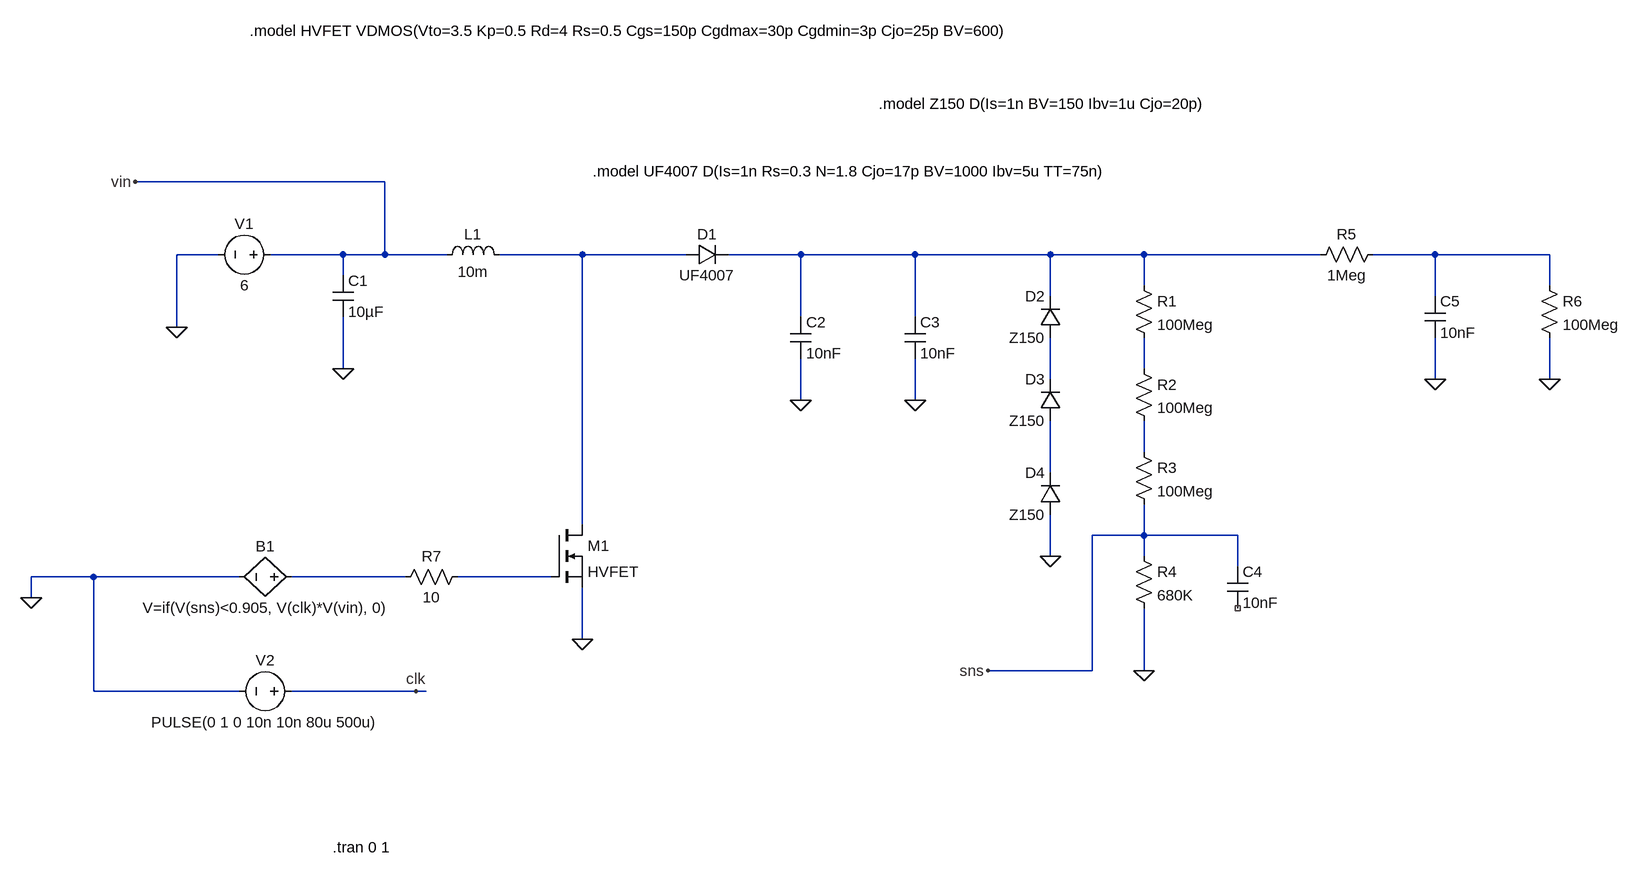
[diagram p0: schematic Draft1.asc]
Draft1.asc, the LTspice schematic file:
Version 4.1
SHEET 1 2132 880
WIRE 224 -160 -160 -160
WIRE -32 -48 -96 -48
WIRE 160 -48 48 -48
WIRE 224 -48 224 -160
WIRE 224 -48 160 -48
WIRE 320 -48 224 -48
WIRE 528 -48 400 -48
WIRE 688 -48 528 -48
WIRE 864 -48 752 -48
WIRE 1040 -48 864 -48
WIRE 1248 -48 1040 -48
WIRE 1392 -48 1248 -48
WIRE 1664 -48 1392 -48
WIRE 1840 -48 1744 -48
WIRE 2016 -48 1840 -48
WIRE 160 -16 160 -48
WIRE 1392 0 1392 -48
WIRE 2016 0 2016 -48
WIRE 1248 16 1248 -48
WIRE 1840 16 1840 -48
WIRE 864 48 864 -48
WIRE 1040 48 1040 -48
WIRE -96 64 -96 -48
WIRE 160 128 160 48
WIRE 1392 128 1392 80
WIRE 1248 144 1248 80
WIRE 1840 144 1840 80
WIRE 2016 144 2016 80
WIRE 864 176 864 112
WIRE 1040 176 1040 112
WIRE 1392 256 1392 208
WIRE 1248 288 1248 208
WIRE 528 368 528 -48
WIRE 1392 384 1392 336
WIRE 1392 384 1312 384
WIRE 1536 384 1392 384
WIRE 1248 416 1248 352
WIRE 1392 416 1392 384
WIRE 1536 432 1536 384
WIRE -224 448 -320 448
WIRE 0 448 -224 448
WIRE 256 448 80 448
WIRE 480 448 336 448
WIRE -320 480 -320 448
WIRE 528 544 528 464
WIRE 1312 592 1312 384
WIRE 1312 592 1152 592
WIRE 1392 592 1392 496
WIRE -224 624 -224 448
WIRE 0 624 -224 624
WIRE 272 624 80 624
WIRE 288 624 272 624
FLAG -160 -160 vin
FLAG 1152 592 sns
FLAG -320 480 0
FLAG 272 624 clk
FLAG 528 544 0
FLAG -96 64 0
FLAG 1392 592 0
FLAG 1840 144 0
FLAG 2016 144 0
FLAG 1248 416 0
FLAG 1040 176 0
FLAG 864 176 0
FLAG 160 128 0
SYMBOL voltage 64 -48 R90
WINDOW 0 -32 56 VBottom 2
WINDOW 3 32 56 VTop 2
SYMATTR InstName V1
SYMATTR Value 6
SYMBOL cap 144 -16 R0
SYMATTR InstName C1
SYMATTR Value 10µF
SYMBOL ind 304 -32 R270
WINDOW 0 32 56 VTop 2
WINDOW 3 5 56 VBottom 2
SYMATTR InstName L1
SYMATTR Value 10m
SYMATTR SpiceLine Ipk=0.1 Rser=12 Cpar=15p
SYMBOL diode 688 -32 R270
WINDOW 0 32 32 VTop 2
WINDOW 3 0 32 VBottom 2
SYMATTR InstName D1
SYMATTR Value UF4007
SYMBOL cap 848 48 R0
SYMATTR InstName C2
SYMATTR Value 10nF
SYMATTR SpiceLine V=1000
SYMBOL cap 1024 48 R0
SYMATTR InstName C3
SYMATTR Value 10nF
SYMATTR SpiceLine V=1000
SYMBOL diode 1264 80 R180
WINDOW 0 24 64 Left 2
WINDOW 3 24 0 Left 2
SYMATTR InstName D2
SYMATTR Value Z150
SYMBOL diode 1264 208 R180
WINDOW 0 24 64 Left 2
WINDOW 3 24 0 Left 2
SYMATTR InstName D3
SYMATTR Value Z150
SYMBOL diode 1264 352 R180
WINDOW 0 24 64 Left 2
WINDOW 3 24 0 Left 2
SYMATTR InstName D4
SYMATTR Value Z150
SYMBOL res 1376 -16 R0
SYMATTR InstName R1
SYMATTR Value 100Meg
SYMBOL res 1376 112 R0
SYMATTR InstName R2
SYMATTR Value 100Meg
SYMBOL res 1376 240 R0
SYMATTR InstName R3
SYMATTR Value 100Meg
SYMBOL res 1376 400 R0
SYMATTR InstName R4
SYMATTR Value 680K
SYMBOL cap 1520 432 R0
SYMATTR InstName C4
SYMATTR Value 10nF
SYMBOL res 1760 -64 R90
WINDOW 0 0 56 VBottom 2
WINDOW 3 32 56 VTop 2
SYMATTR InstName R5
SYMATTR Value 1Meg
SYMBOL res 2000 -16 R0
SYMATTR InstName R6
SYMATTR Value 100Meg
SYMBOL cap 1824 16 R0
SYMATTR InstName C5
SYMATTR Value 10nF
SYMBOL voltage 96 624 R90
WINDOW 0 -32 56 VBottom 2
WINDOW 3 32 56 VTop 2
WINDOW 123 0 0 Left 0
WINDOW 39 0 0 Left 0
SYMATTR InstName V2
SYMATTR Value PULSE(0 1 0 10n 10n 80u 500u)
SYMBOL bv 96 448 R90
WINDOW 0 -32 56 VBottom 2
WINDOW 3 32 56 VTop 2
SYMATTR InstName B1
SYMATTR Value V=if(V(sns)<0.905, V(clk)*V(vin), 0)
SYMBOL res 352 432 R90
WINDOW 0 0 56 VBottom 2
WINDOW 3 32 56 VTop 2
SYMATTR InstName R7
SYMATTR Value 10
SYMBOL nmos 480 368 R0
SYMATTR InstName M1
SYMATTR Value HVFET
TEXT 544 -176 Left 2 !.model UF4007 D(Is=1n Rs=0.3 N=1.8 Cjo=17p BV=1000 Ibv=5u TT=75n)
TEXT 984 -280 Left 2 !.model Z150 D(Is=1n BV=150 Ibv=1u Cjo=20p)
TEXT 16 -392 Left 2 !.model HVFET VDMOS(Vto=3.5 Kp=0.5 Rd=4 Rs=0.5 Cgs=150p Cgdmax=30p Cgdmin=3p Cjo=25p BV=600)
TEXT 144 864 Left 2 !.tran 0 1

The netlist it stands for:
* Draft1.asc
V1 vin 0 6
C1 vin 0 10µF
L1 vin N001 10m Ipk=0.1 Rser=12 Cpar=15p
D1 N001 N002 UF4007
C2 N002 0 10nF V=1000
C3 N002 0 10nF V=1000
D2 N005 N002 Z150
D3 N007 N005 Z150
D4 0 N007 Z150
R1 N002 N004 100Meg
R2 N004 N006 100Meg
R3 N006 sns 100Meg
R4 sns 0 680K
C4 sns NC_01 10nF
R5 N003 N002 1Meg
R6 N003 0 100Meg
C5 N003 0 10nF
V2 clk 0 PULSE(0 1 0 10n 10n 80u 500u)
B1 N008 0 V=if(V(sns)<0.905, V(clk)*V(vin), 0)
R7 N009 N008 10
M1 N001 N009 0 0 HVFET
.model D D
.lib standard.dio
.model NMOS NMOS
.model PMOS PMOS
.lib standard.mos
.model UF4007 D(Is=1n Rs=0.3 N=1.8 Cjo=17p BV=1000 Ibv=5u TT=75n)
.model Z150 D(Is=1n BV=150 Ibv=1u Cjo=20p)
.model HVFET VDMOS(Vto=3.5 Kp=0.5 Rd=4 Rs=0.5 Cgs=150p Cgdmax=30p Cgdmin=3p Cjo=25p BV=600)
.tran 0 1
.backanno
.end